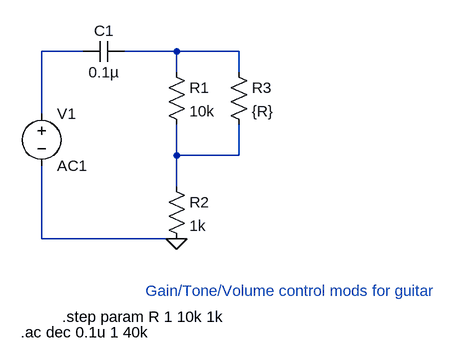
[diagram p0: schematic Guitar Controls.asc]
Guitar Controls.asc, the LTspice schematic file:
Version 4
SHEET 1 880 680
WIRE 32 112 -32 112
WIRE 176 112 96 112
WIRE 272 112 176 112
WIRE 176 144 176 112
WIRE 272 144 272 112
WIRE -32 208 -32 112
WIRE 176 272 176 224
WIRE 272 272 272 224
WIRE 272 272 176 272
WIRE 176 320 176 272
WIRE -32 400 -32 288
WIRE 176 400 -32 400
FLAG 176 400 0
SYMBOL res 160 128 R0
SYMATTR InstName R1
SYMATTR Value 10k
SYMBOL res 160 304 R0
SYMATTR InstName R2
SYMATTR Value 1k
SYMBOL res 256 128 R0
SYMATTR InstName R3
SYMATTR Value {R}
SYMBOL voltage -32 192 R0
SYMATTR InstName V1
SYMATTR Value AC1
SYMBOL cap 96 96 R90
WINDOW 0 0 32 VBottom 2
WINDOW 3 32 32 VTop 2
SYMATTR InstName C1
SYMATTR Value 0.1µ
TEXT 0 520 Left 2 !.step param R 1 10k 1k
TEXT -64 544 Left 2 !.ac dec 0.1u 1 40k
TEXT 128 480 Left 2 ;Gain/Tone/Volume control mods for guitar

The netlist it stands for:
* Guitar Controls.asc
R1 N002 N003 10k
R2 N003 0 1k
R3 N002 N003 {R}
V1 N001 0 AC1
C1 N002 N001 0.1µ
.step param R 1 10k 1k
.ac dec 0.1u 1 40k
* Gain/Tone/Volume control mods for guitar
.backanno
.end